# Altium schematic sheet 17_I2C_Sensor_OnBoard.SchDoc
size 420 x 297 mm; SheetNumber: 27; SheetTotal: 33
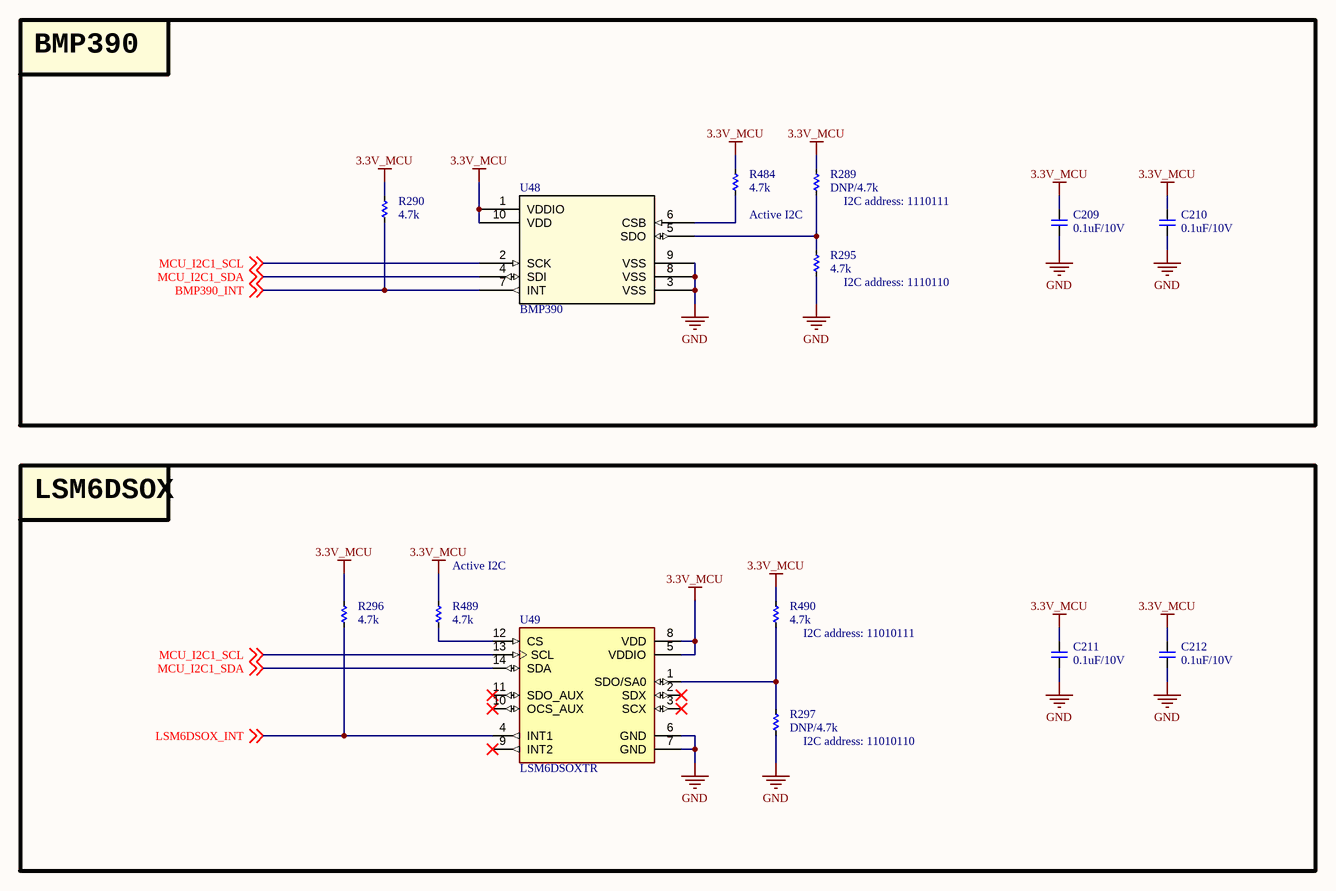
[diagram p0: 17_I2C_Sensor_OnBoard.SchDoc]

## Parts
C209  0.1uF/10V  [CAP_C_1005X50_L]
C210  0.1uF/10V  [CAP_C_1005X50_L]
C211  0.1uF/10V  [CAP_C_1005X50_L]
C212  0.1uF/10V  [CAP_C_1005X50_L]
R289  DNP/4.7k  [RES_C_1005x30_L]
R290  4.7k  [RES_C_0603X30]
R295  4.7k  [RES_C_1005x30_L]
R296  4.7k  [RES_C_1005x30_L]
R297  DNP/4.7k  [RES_C_1005x30_L]
R484  4.7k  [RES_C_1005x30_L]
R489  4.7k  [RES_C_1005x30_L]
R490  4.7k  [RES_C_1005x30_L]
U48  BMP390  [10LGA_2X2X0p75_BOS]
U49  LSM6DSOXTR  [PQFN50P250X300X86-14N]

## Blocks framed on the sheet
BMP390: C209 C210 R289 R290 R295 R484 U48
LSM6DSOX: C211 C212 R296 R297 R489 R490 U49

## Nets
3.3V_MCU: C209.2 C210.2 C211.2 C212.2 R289.1 R290.1 R296.1 R484.1 R489.1 R490.1 U48.1(VDDIO) U48.10(VDD) U49.5(VDDIO) U49.8(VDD)
GND: C209.1 C210.1 C211.1 C212.1 R295.2 R297.2 U48.3(VSS) U48.8(VSS) U48.9(VSS) U49.6(GND) U49.7(GND)
BMP390_INT: R290.2 U48.7(INT) ; off-sheet BMP390_INT
LSM6DSOX_INT: R296.2 U49.4(INT1) ; off-sheet LSM6DSOX_INT
MCU_I2C1_SCL: U48.2(SCK) U49.13(SCL) ; off-sheet MCU_I2C1_SCL
MCU_I2C1_SDA: U48.4(SDI) U49.14(SDA) ; off-sheet MCU_I2C1_SDA
NetR289_2: R289.2 R295.1 U48.5(SDO)
NetR297_1: R297.1 R490.2 U49.1(SDO/SA0)
NetR484_2: R484.2 U48.6(CSB)
NetR489_2: R489.2 U49.12(CS)

Not connected (* = marked no-connect by the designer): U49 2(SDX)* 3(SCX)* 9(INT2)* 10(OCS_AUX)* 11(SDO_AUX)*

## Notes on the sheet
- Active I2C
- (near R289) I2C address: 1110111
- (near R295) I2C address: 1110110
- (near R489) Active I2C
- (near R490) I2C address: 11010111
- (near R297) I2C address: 11010110
- Project:
- BEE-1012
- Sub-system:
- SATELLITE_EXP_CONTROLLER
- Design by:
- SANG HUYNH
- BAO BUI
- Sheet title:
- Sheet
- A3
- of
- Checked by:
- Approved by:
- VU PHAM
- Revision:
- Document No:
- Size:
- Date:

## Library data of the parts
C209-C212 = _CAP_C_2: CAP
R289 R290 R295-R297 R484 R489 R490 = _RES_B_2: RES
U48 = BMP390: Description; Manufacturer_Name: Bosch Sensortec; Copyright: Copyright (C) 2025 Ultra Librarian. All rights reserved.; Manufacturer_Part_Number: BMP390; RefDes: RefDes; Type: Type
U49 = LSM6DSOXTR: Accelerometer, Gyroscope, 6 Axis Sensor I2C, SPI Output; MF: STMicroelectronics; SnapEDA_Link: https://www.snapeda.com/parts/LSM6DSOXTR/STMicroelectronics/view-part/?ref=snap; Package: VFLGA-14 STMicroelectronics; Value: *; MP: LSM6DSOXTR; Check_prices: https://www.snapeda.com/parts/LSM6DSOXTR/STMicroelectronics/view-part/?ref=eda